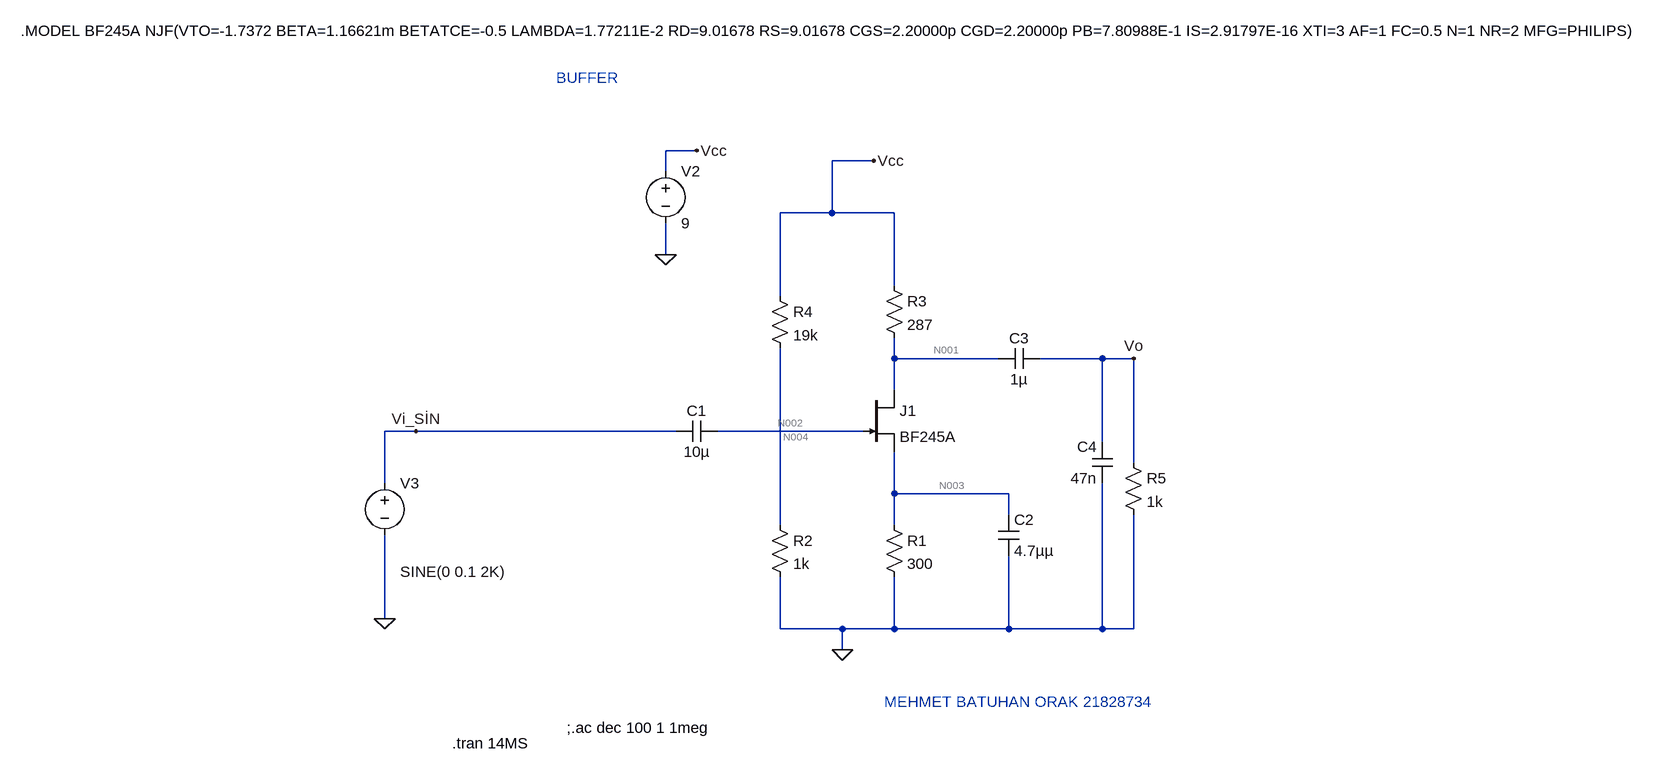
[diagram p0: schematic 1-buffer.asc]
1-buffer.asc, the LTspice schematic file:
Version 4
SHEET 1 2828 708
WIRE 240 -336 192 -336
WIRE 512 -320 448 -320
WIRE 192 -304 192 -336
WIRE 448 -240 448 -320
WIRE 448 -240 368 -240
WIRE 544 -240 448 -240
WIRE 192 -176 192 -224
WIRE 544 -128 544 -240
WIRE 368 -112 368 -240
WIRE 544 -16 544 -48
WIRE 704 -16 544 -16
WIRE 864 -16 768 -16
WIRE 912 -16 864 -16
WIRE 544 32 544 -16
WIRE -192 96 -240 96
WIRE 208 96 -192 96
WIRE 496 96 272 96
WIRE 864 112 864 -16
WIRE 912 144 912 -16
WIRE -240 176 -240 96
WIRE 544 192 544 128
WIRE 720 192 544 192
WIRE 720 224 720 192
WIRE 368 240 368 -32
WIRE 544 240 544 192
WIRE -240 384 -240 256
WIRE 368 400 368 320
WIRE 464 400 368 400
WIRE 544 400 544 320
WIRE 544 400 464 400
WIRE 720 400 720 288
WIRE 720 400 544 400
WIRE 864 400 864 176
WIRE 864 400 720 400
WIRE 912 400 912 224
WIRE 912 400 864 400
WIRE 464 432 464 400
FLAG 464 432 0
FLAG 192 -176 0
FLAG 912 -16 Vo
FLAG 512 -320 Vcc
FLAG 240 -336 Vcc
FLAG -192 96 Vi_SİN
FLAG -240 384 0
SYMBOL njf 496 32 R0
SYMATTR InstName J1
SYMATTR Value BF245A
SYMBOL res 528 224 R0
SYMATTR InstName R1
SYMATTR Value 300
SYMBOL res 352 224 R0
SYMATTR InstName R2
SYMATTR Value 1k
SYMBOL res 528 -144 R0
SYMATTR InstName R3
SYMATTR Value 287
SYMBOL res 352 -128 R0
SYMATTR InstName R4
SYMATTR Value 19k
SYMBOL cap 272 80 R90
WINDOW 0 0 32 VBottom 2
WINDOW 3 32 32 VTop 2
SYMATTR InstName C1
SYMATTR Value 10µ
SYMBOL cap 704 224 R0
SYMATTR InstName C2
SYMATTR Value 4.7µµ
SYMBOL cap 768 -32 R90
WINDOW 0 0 32 VBottom 2
WINDOW 3 32 32 VTop 2
SYMATTR InstName C3
SYMATTR Value 1µ
SYMBOL res 896 128 R0
SYMATTR InstName R5
SYMATTR Value 1k
SYMBOL voltage 192 -320 R0
WINDOW 123 0 0 Left 0
WINDOW 39 0 0 Left 0
SYMATTR InstName V2
SYMATTR Value 9
SYMBOL cap 880 176 R180
WINDOW 0 24 56 Left 2
WINDOW 3 24 8 Left 2
SYMATTR InstName C4
SYMATTR Value 47n
SYMBOL voltage -240 160 R0
WINDOW 123 24 124 Left 2
WINDOW 39 0 0 Left 0
WINDOW 3 24 152 Left 2
SYMATTR Value SINE(0 0.1 2K)
SYMATTR InstName V3
TEXT 24 -448 Left 2 ;BUFFER
TEXT -800 -520 Left 2 !.MODEL BF245A NJF(VTO=-1.7372 BETA=1.16621m BETATCE=-0.5 LAMBDA=1.77211E-2 RD=9.01678 RS=9.01678 CGS=2.20000p CGD=2.20000p PB=7.80988E-1 IS=2.91797E-16 XTI=3 AF=1 FC=0.5 N=1 NR=2 MFG=PHILIPS)
TEXT 40 552 Left 2 !;.ac dec 100 1 1meg
TEXT 528 512 Left 2 ;MEHMET BATUHAN ORAK 21828734
TEXT -136 576 Left 2 !.tran 14MS

The netlist it stands for:
* 1-buffer.asc
J1 N001 N002 N003 BF245A
R1 N003 0 300
R2 N004 0 1k
R3 Vcc N001 287
R4 Vcc N004 19k
C1 N002 Vi_SİN 10µ
C2 N003 0 4.7µµ
C3 Vo N001 1µ
R5 Vo 0 1k
V2 Vcc 0 9
C4 0 Vo 47n
V3 Vi_SİN 0 SINE(0 0.1 2K)
.model NJF NJF
.model PJF PJF
.lib standard.jft
* BUFFER
.MODEL BF245A NJF(VTO=-1.7372 BETA=1.16621m BETATCE=-0.5 LAMBDA=1.77211E-2 RD=9.01678 RS=9.01678 CGS=2.20000p CGD=2.20000p PB=7.80988E-1 IS=2.91797E-16 XTI=3 AF=1 FC=0.5 N=1 NR=2 MFG=PHILIPS)
;.ac dec 100 1 1meg
* MEHMET BATUHAN ORAK 21828734
.tran 14MS
.backanno
.end

* Results of the author's LTspice run, read from the files saved beside the schematic
* Operating Point, zero values left out:
*   V(n001) = 7.548 V
*   V(n002) = 1.807 V
*   V(n003) = 1.518 V
*   V(n004) = 450 mV
*   V(vcc) = 9 V
*   Id(J1) = 5.059 mA
*   Ig(J1) = -1.807 pA
*   Is(J1) = -5.059 mA
*   I(R4) = 450 µA
*   I(R3) = 5.059 mA
*   I(R2) = 450 µA
*   I(R1) = 5.059 mA
*   I(V2) = -5.509 mA
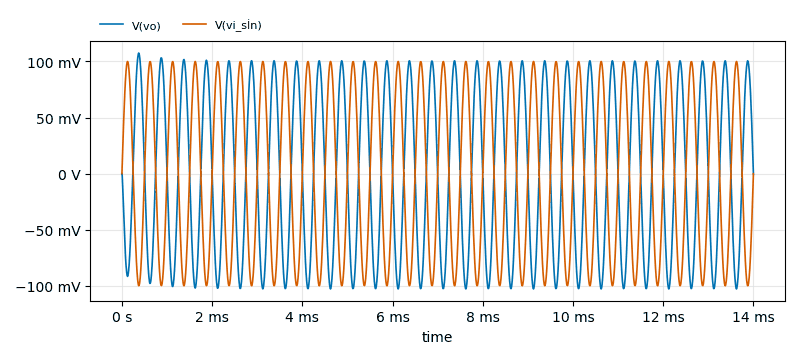
[diagram p1: Transient Analysis of 1-buffer.asc, plotted from the saved traces]
* Transient Analysis, 1 run:
*   V(vo): min -102.8 mV, max 107.5 mV, average 532.6 µV, rms 71.6 mV, last -590.7 µV
*   V(vi_sİn): min -99.98 mV, max 100 mV, average 434.3 nV, rms 70.73 mV, last 0 V